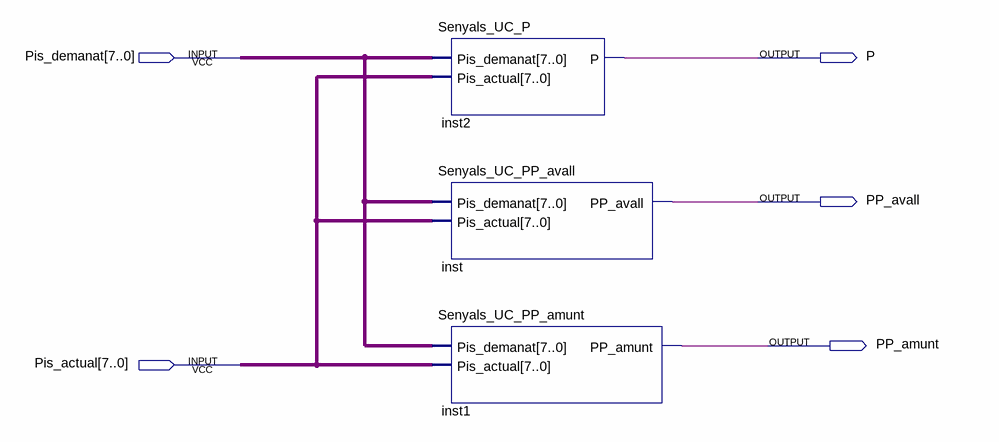
[diagram p0: schematic sheet]
// Quartus schematic Senyals_UC.bdf as structural Verilog: 3 symbols, 5 pins
module Senyals_UC (
  input  [7:0] Pis_demanat,
  input  [7:0] Pis_actual,
  output P,
  output PP_avall,
  output PP_amunt
);

  Senyals_UC_P inst2 (.Pis_demanat(Pis_demanat), .Pis_actual(Pis_actual), .P(P));
  Senyals_UC_PP_avall inst (.Pis_demanat(Pis_demanat), .Pis_actual(Pis_actual), .PP_avall(PP_avall));
  Senyals_UC_PP_amunt inst1 (.Pis_demanat(Pis_demanat), .Pis_actual(Pis_actual), .PP_amunt(PP_amunt));
endmodule
